# Altium schematic sheet ESP32.SchDoc
size A4; SheetNumber: 1; SheetTotal: 1
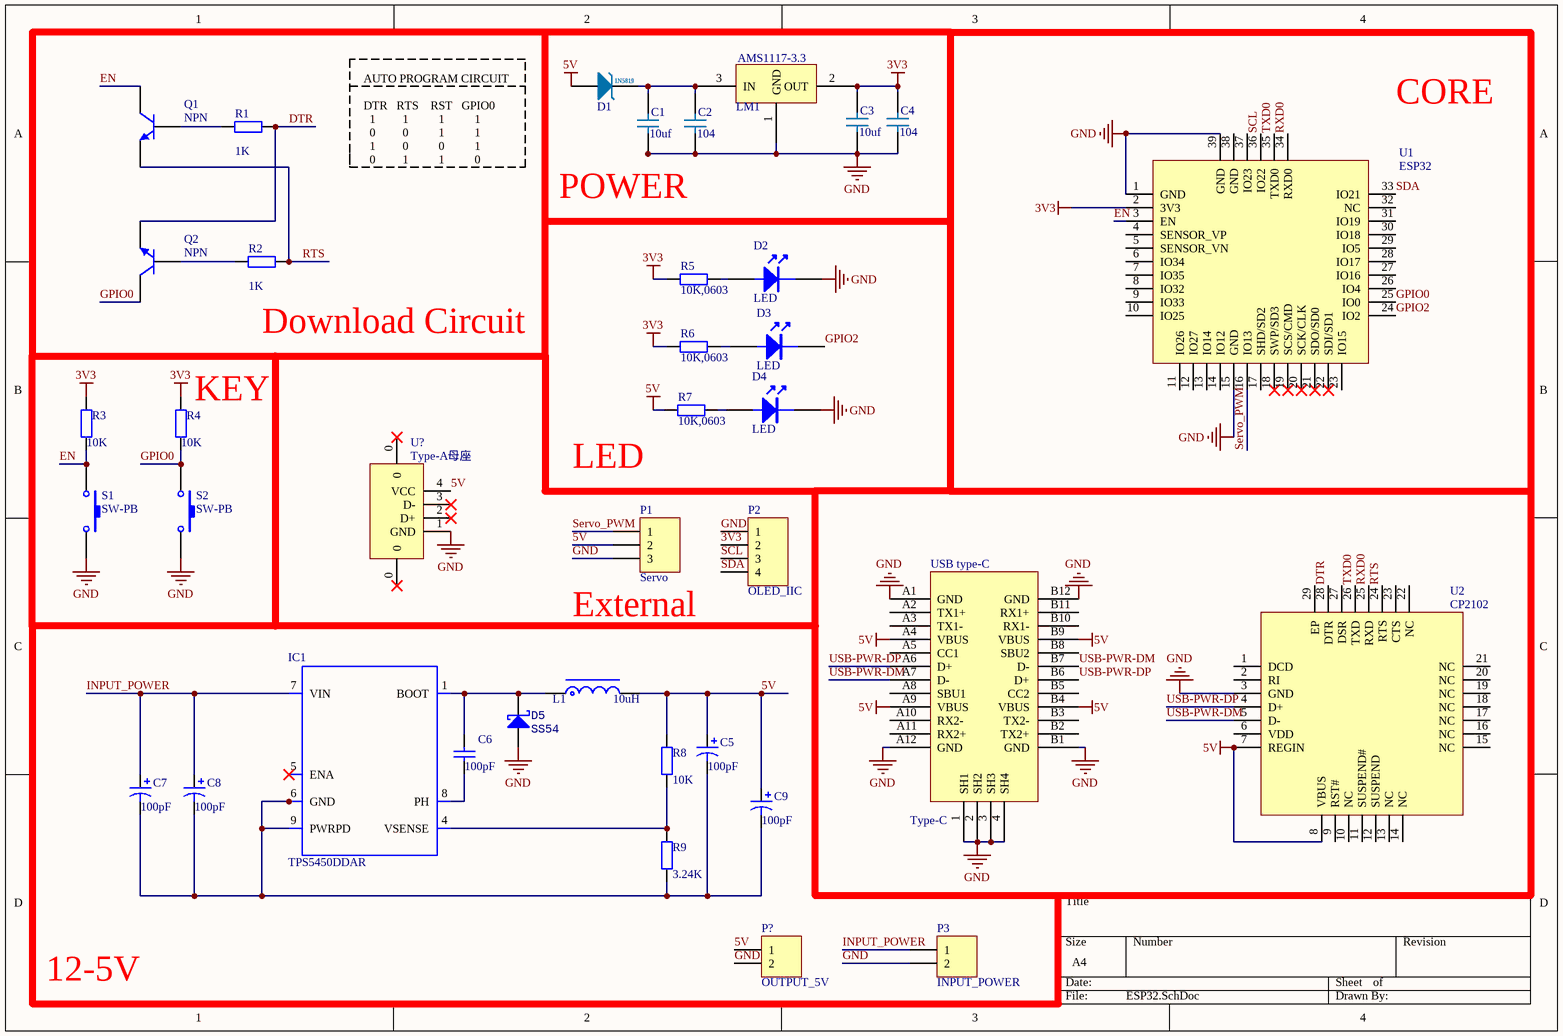
[diagram p0: ESP32.SchDoc]

## Parts
C1  10uf  [0603]
C2  104  [0603]
C3  10uf  [0603]
C4  104  [0603]
C5  value 100pF  [C0805]  (hidden comment: Cap Pol3)
C6  value 100pF  [RAD-0.3]  (hidden comment: Cap)
C7  value 100pF  [C0805]  (hidden comment: Cap Pol3)
C8  value 100pF  [C0805]  (hidden comment: Cap Pol3)
C9  value 100pF  [C0805]  (hidden comment: Cap Pol3)
D1  1N5819  [SOD-323]  (value not drawn)
D2  LED  [LED 0603G]
D3  LED  [LED 0603G]
D4  LED  [LED 0603G]
D5  SS54  [SMC]
IC1  PackageReference: TPS5450DDAR  [ESOP8_N]  (hidden comment: TPS5450)
L1  10uH  [L-SMD-1040]
LM1  AMS1117-3.3  [SOT-223]
P1  Servo  [HDR1X3]
P2  OLED_IIC  [HDR1X4]
P3  INPUT_POWER  [HDR1X2]
P?  OUTPUT_5V  [HDR1X2]
Q1  NPN  [TO-226-AA]
Q2  NPN  [TO-226-AA]
R1  value 1K  [R 0603_L]  (hidden comment: Res2)
R2  value 1K  [R 0603_L]  (hidden comment: Res2)
R3  value 10K  [R 0603_L]  (hidden comment: Res2)
R4  value 10K  [R 0603_L]  (hidden comment: Res2)
R5  10K,0603  [0603]
R6  10K,0603  [0603]
R7  10K,0603  [0603]
R8  value 10K  [R 0603_L]  (hidden comment: Res2)
R9  value 3.24K  [R 0603_L]  (hidden comment: Res2)
S1  SW-PB  [TSW SMD-3*6*2.5]
S2  SW-PB  [TSW SMD-3*6*2.5]
U1  ESP32  [ESP32_WROOM_32]
U2  CP2102
U?  Type-A母座  [USB-A/S_A]
USB_type-C  Type-C  [Type-C]

## Nets
3V3: C3.2 C4.2 LM1.2(OUT) P2.2 R3.2 R4.2 R5.1 R6.1 U1.2(3V3)
5V: C5.1 C9.1 D1.1(A) L1.2 P1.2 P?.1 R7.1 R8.2 U2.7(REGIN) U2.8(VBUS) U?.4(VCC) USB_type-C.A4(VBUS) USB_type-C.A9(VBUS) USB_type-C.B4(VBUS) USB_type-C.B9(VBUS)
GND: C1.1 C2.1 C3.1 C4.1 D2.K D4.K D5.1(A) LM1.1(GND) P1.3 P2.1 P3.2 P?.2 S1.2 S2.2 U1.1(GND) U1.15(GND) U1.39(GND) U2.3(GND) U?.1(GND) USB_type-C.1(SH1) USB_type-C.2(SH2) USB_type-C.3(SH3) USB_type-C.4(SH4) USB_type-C.A1(GND) USB_type-C.A12(GND) USB_type-C.B1(GND) USB_type-C.B12(GND)
DTR: Q2.3(E) R1.2 U2.28(DTR)
EN: Q1.1(C) R3.1 S1.1 U1.3(EN)
GPIO0: Q2.1(C) R4.1 S2.1 U1.25(IO0)
GPIO2: D3.K U1.24(IO2)
INPUT_POWER: C7.1 C8.1 IC1.7(VIN) P3.1
RTS: Q1.3(E) R2.2 U2.24(RTS)
RXD0: U1.34(RXD0) U2.25(RXD)
SCL: P2.3 U1.36(IO22)
SDA: P2.4 U1.33(IO21)
Servo_PWM: P1.1 U1.16(IO13)
TXD0: U1.35(TXD0) U2.26(TXD)
USB-PWR-DM: U2.5(D-) USB_type-C.A7(D-) USB_type-C.B7(D-)
USB-PWR-DP: U2.4(D+) USB_type-C.A6(D+) USB_type-C.B6(D+)
NetC1_2: C1.2 C2.2 D1.2(K) LM1.3(IN)
NetC5_2: C5.2 C7.2 C8.2 C9.2 IC1.2(NC) IC1.3(NC) IC1.6(GND) IC1.9(PWRPD) R9.1
NetC6_1: C6.1 IC1.8(PH)
NetC6_2: C6.2 D5.2(K) IC1.1(BOOT) L1.1
NetD2_A: D2.A R5.2
NetD3_A: D3.A R6.2
NetD4_A: D4.A R7.2
NetIC1_4: IC1.4(VSENSE) R8.1 R9.2
NetQ1_2: Q1.2(B) R1.1
NetQ2_2: Q2.2(B) R2.1

Not connected (* = marked no-connect by the designer): IC1 5(ENA)*; U1 4(SENSOR_VP) 5(SENSOR_VN) 6(IO34) 7(IO35) 8(IO32) 9(IO33) 10(IO25) 11(IO26) 12(IO27) 13(IO14) 14(IO12) 17(SHD/SD2) 18(SWP/SD3)* 19(SCS/CMD)* 20(SCK/CLK)* 21(SDO/SD0)* 22(SDI/SD1)* 23(IO15) 26(IO4) 27(IO16) 28(IO17) 29(IO5) 30(IO18) 31(IO19) 32(NC) 37(IO23) 38(GND); U2 1(DCD) 2(RI) 6(VDD) 9(RST#) 10(NC) 11(SUSPEND#) 12(SUSPEND) 13(NC) 14(NC) 15(NC) 16(NC) 17(NC) 18(NC) 19(NC) 20(NC) 21(NC) 22(NC) 23(CTS) 27(DSR) 29(EP); U? 0* 2(D+)* 3(D-)*; USB_type-C A2(TX1+) A3(TX1-) A5(CC1) A8(SBU1) A10(RX2-) A11(RX2+) B2(TX2+) B3(TX2-) B5(CC2) B8(SBU2) B10(RX1-) B11(RX1+)

## Notes on the sheet
- CORE
- AUTO PROGRAM CIRCUIT
  DTR   RTS    RST   GPIO0
  1         1          1          1
  0         0          1          1
  1         0          0          1
  0         1          1          0
- (near C1) POWER
- (near R2) Download Circuit
- (near R4) KEY
- LED
- External
- 12-5V

## Library data of the parts
C1-C4 = CAP-0603
C5 C7-C9 = Cap Pol3: Polarized Capacitor (Surface Mount); Published: 8-Jun-2000; LatestRevisionDate: 29-May-2009; LatestRevisionNote: IPC-7351 Footprint Added.; PackageReference: C0805; Publisher: Altium Limited; PackageDescription: Chip Capacitor
C6 = Cap: Capacitor; Published: 8-Jun-2000; LatestRevisionDate: 17-Jul-2002; LatestRevisionNote: Re-released for DXP Platform.; PackageReference: RAD-0.3; Publisher: Altium Limited; PackageDescription: Radial Cap, Thru-Hole; 2 Leads; 0.3 in Pin Spacing
D5 = SS54: 肖特基二极管
IC1 = TPS5450: DC-Buck芯片 | TPS5450DDAR| 5A | 500KHz | Input Voltage Range: 5.5 V to 36 V | / Up to 5-A Continuous (6-A Peak) Output Current | Efficiency Greater Than 90%; Manufacturer Name: Texas Instruments; Manufacturer Part Number: TPS5450DDA; Value: N/A
L1 = L-CD: 贴片功率电感; BOM名称: 功率电感; 版权归属: 源创客; 学习资源: www.ooocke.com
LM1 = LM1117-3.3
P1 = Header 3: Header, 3-Pin; LatestRevisionDate: 17-Jul-2002; LatestRevisionNote: Re-released for DXP Platform.; Publisher: Altium Limited
P2 = Header 4: Header, 4-Pin; LatestRevisionDate: 17-Jul-2002; LatestRevisionNote: Re-released for DXP Platform.; Publisher: Altium Limited
P3 P? = Header 2: Header, 2-Pin; LatestRevisionDate: 17-Jul-2002; LatestRevisionNote: Re-released for DXP Platform.; Publisher: Altium Limited
Q1 Q2 = NPN: NPN Bipolar Transistor; Published: 8-Jun-2000; LatestRevisionDate: 17-Jul-2002; LatestRevisionNote: Re-released for DXP Platform.; PackageReference: TO-226-AA; Publisher: Altium Limited; PackageDescription: TO, Flat Index; 3 In-Line, Axial Leads; Body Dia. 4.8mm; Leads 0.55 x 0.51 mm (max); Code_JEDEC: TO-226-AA
R1-R9 = Res2: Resistor; Published: 8-Jun-2000; LatestRevisionDate: 17-Jul-2002; LatestRevisionNote: Re-released for DXP Platform.; Publisher: Altium Limited
  R1-R4 R8 R9: PackageReference: AXIAL-0.4; PackageDescription: Axial Device, Thru-Hole; 2 Leads; 0.4 in Pin Spacing
S1 S2 = SW-PB: Switch; Published: 24-Mar-1999; LatestRevisionDate: 17-Jul-2002; LatestRevisionNote: Re-released for DXP Platform.; PackageReference: SPST-2; Publisher: Altium Limited; PackageDescription: Switch; 2 Leads
U1 = ESP32_WROOM_32